# Altium project E12_STM32H750IBK6_SOM_V1.PrjPcb
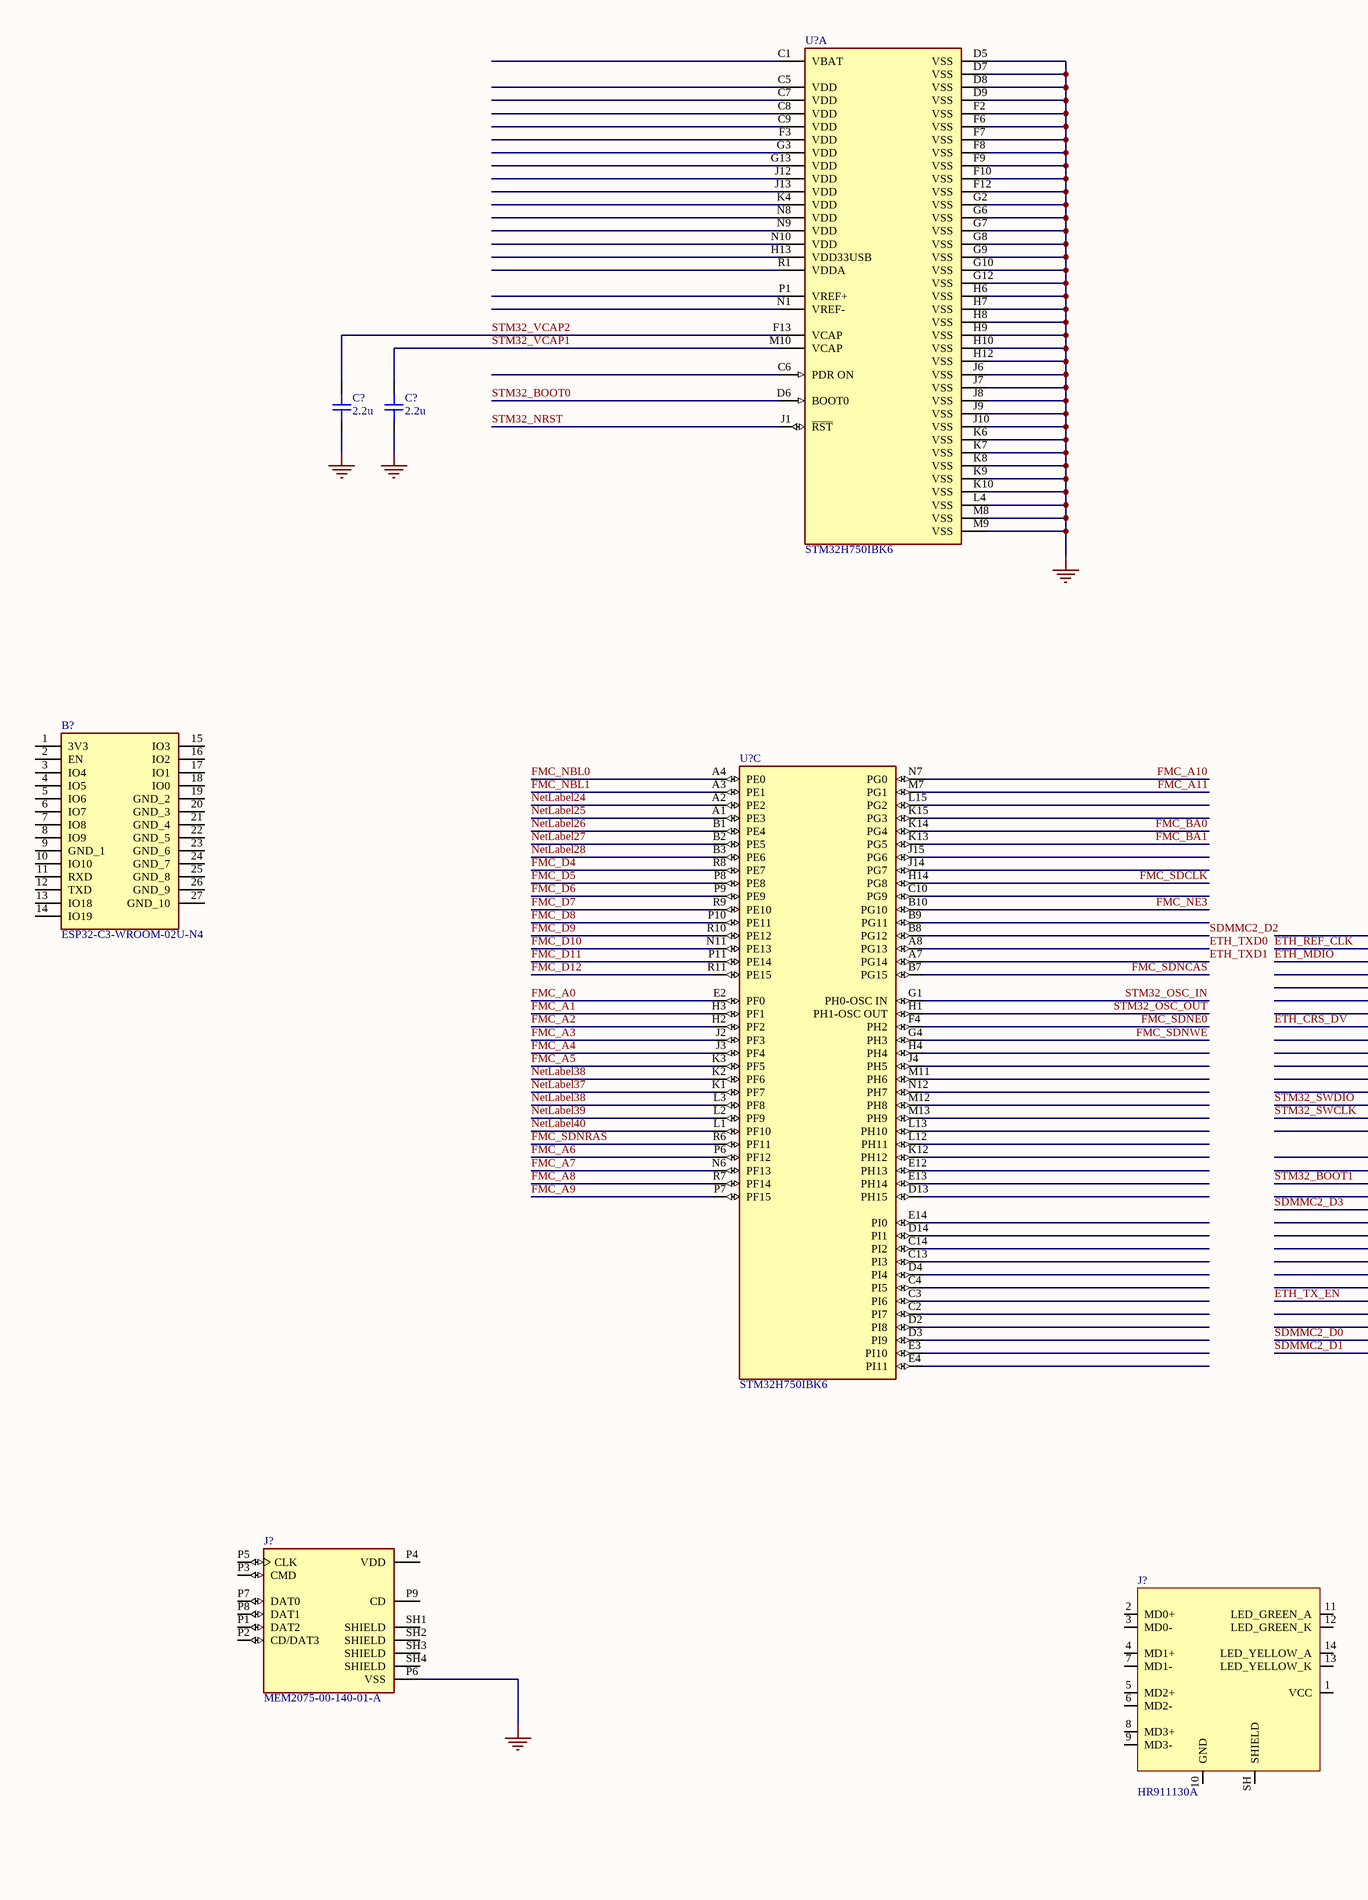
[diagram p0: Schematic1.SchDoc, left]
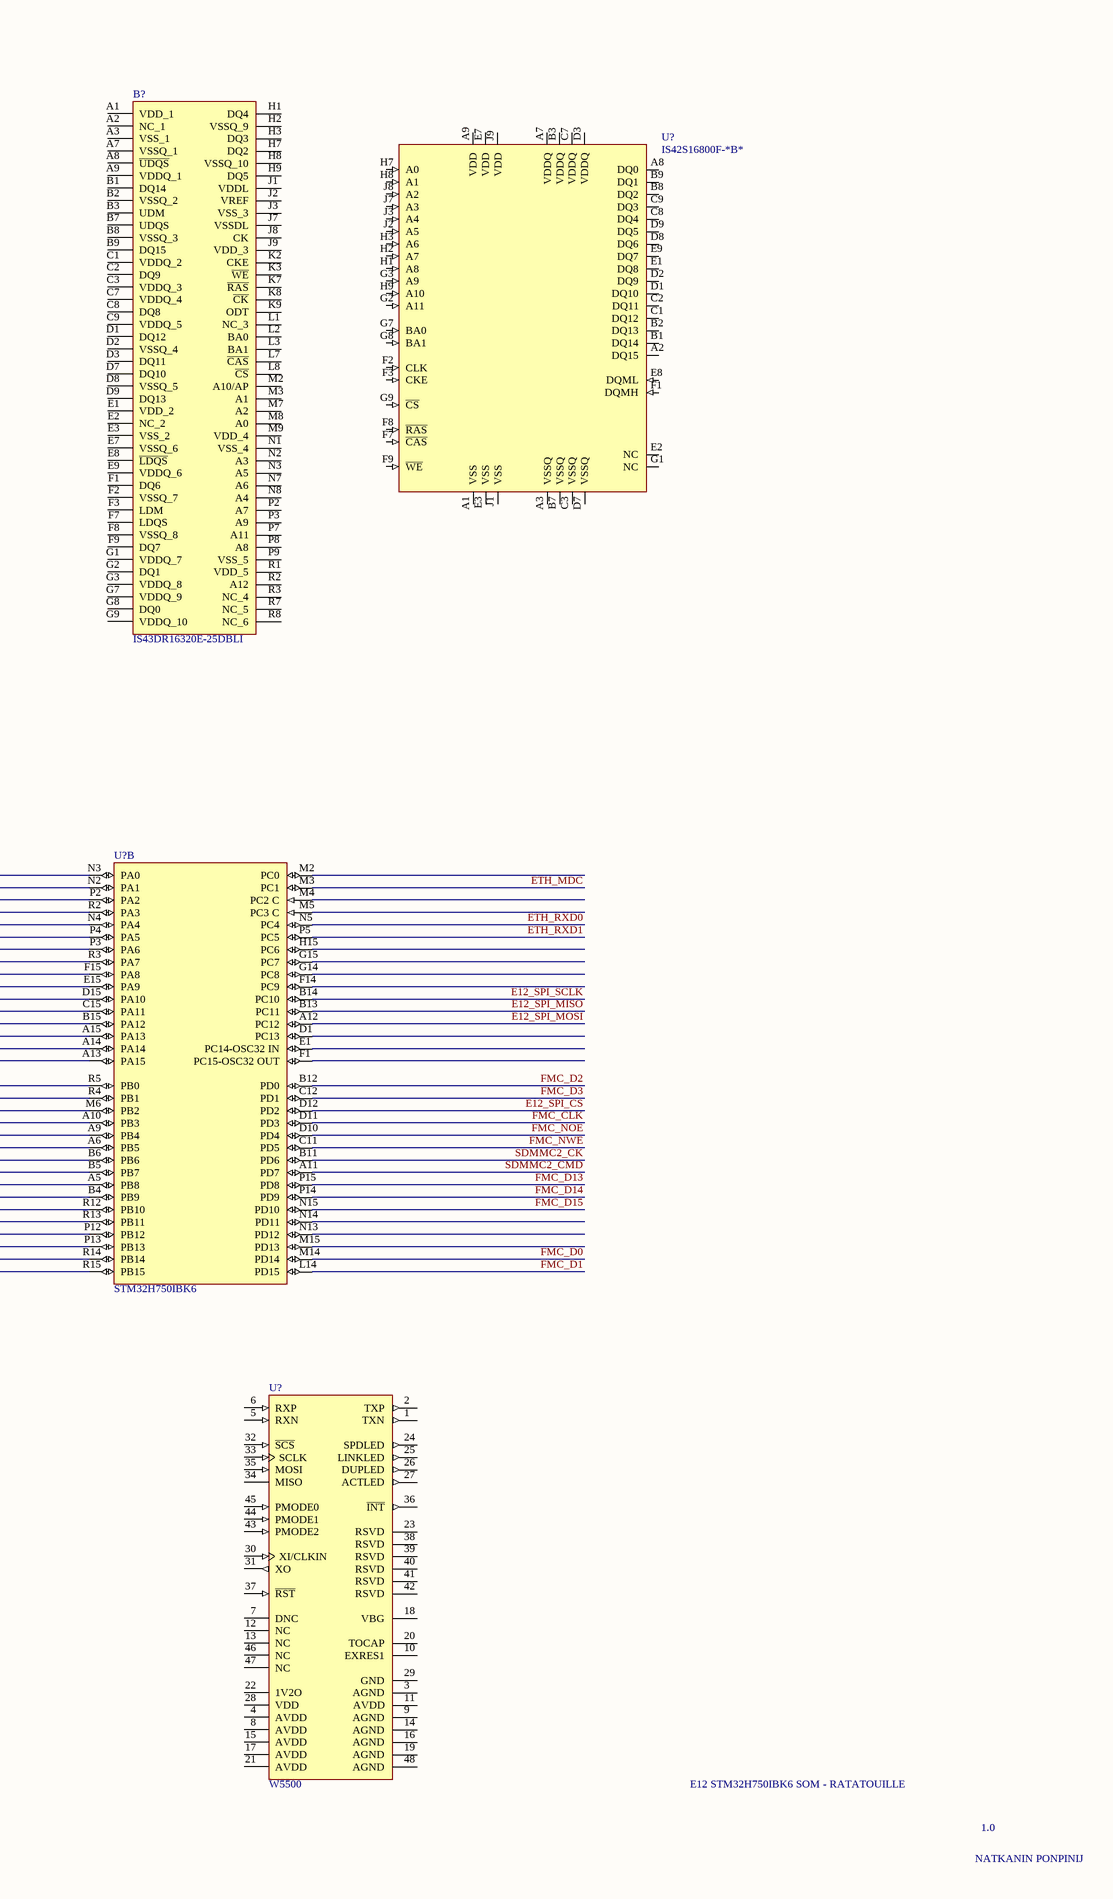
[diagram p1: Schematic1.SchDoc, right]
1 sheet, 11 parts. Net scope: global (net labels, ports and power ports of the same name join across sheets).

## Sheet Schematic1.SchDoc
size A2; SheetNumber: 1; SheetTotal: 1

### Parts
(Parts that share a designator on the sheet are numbered #1, #2 ... from top to bottom, then left to right.)
B?#1  IS43DR16320E-25DBLI  [BGA84C80P9X15_800X1250X120]
B?#2  ESP32-C3-WROOM-02U-N4  [ESP32C3WROOM02UN4]
C?#1  2.2u  [CAP_0402]
C?#2  2.2u  [CAP_0402]
J?#1  MEM2075-00-140-01-A  [GCT_MEM2075-00-140-01-A]
J?#2  HR911130A  [HR911130A]
U?#1  STM32H750IBK6  [FP-UFBGA176+25-A0E7-MFG]  (part A of 3)
U?#2  IS42S16800F-*B*  [BGA54C80P9X9_800X800X120]
U?#3  STM32H750IBK6  [FP-UFBGA176+25-A0E7-MFG]  (part C of 3)
U?#4  STM32H750IBK6  [FP-UFBGA176+25-A0E7-MFG]  (part B of 3)
U?#5  W5500  [WIZ-W5500-LQFP-48_M]

### Nets
GND: C?#1.1 C?#2.1 J?#1.P6(VSS) U?#1.D5(VSS) U?#1.D7(VSS) U?#1.D8(VSS) U?#1.D9(VSS) U?#1.F2(VSS) U?#1.F6(VSS) U?#1.F7(VSS) U?#1.F8(VSS) U?#1.F9(VSS) U?#1.F10(VSS) U?#1.F12(VSS) U?#1.G2(VSS) U?#1.G6(VSS) U?#1.G7(VSS) U?#1.G8(VSS) U?#1.G9(VSS) U?#1.G10(VSS) U?#1.G12(VSS) U?#1.H6(VSS) U?#1.H7(VSS) U?#1.H8(VSS) U?#1.H9(VSS) U?#1.H10(VSS) U?#1.H12(VSS) U?#1.J6(VSS) U?#1.J7(VSS) U?#1.J8(VSS) U?#1.J9(VSS) U?#1.J10(VSS) U?#1.K6(VSS) U?#1.K7(VSS) U?#1.K8(VSS) U?#1.K9(VSS) U?#1.K10(VSS) U?#1.L4(VSS) U?#1.M8(VSS) U?#1.M9(VSS)
E12_SPI_CS: U?#4.D12(PD2)
E12_SPI_MISO: U?#4.B13(PC11)
E12_SPI_MOSI: U?#4.A12(PC12)
E12_SPI_SCLK: U?#4.B14(PC10)
ETH_CRS_DV: U?#4.R3(PA7)
ETH_MDC: U?#4.M3(PC1)
ETH_MDIO: U?#4.P2(PA2)
ETH_REF_CLK: U?#4.N2(PA1)
ETH_RXD0: U?#4.N5(PC4)
ETH_RXD1: U?#4.P5(PC5)
ETH_TX_EN: U?#4.R13(PB11)
ETH_TXD0: U?#3.A8(PG13)
ETH_TXD1: U?#3.A7(PG14)
FMC_A0: U?#3.E2(PF0)
FMC_A1: U?#3.H3(PF1)
FMC_A2: U?#3.H2(PF2)
FMC_A3: U?#3.J2(PF3)
FMC_A4: U?#3.J3(PF4)
FMC_A5: U?#3.K3(PF5)
FMC_A6: U?#3.P6(PF12)
FMC_A7: U?#3.N6(PF13)
FMC_A8: U?#3.R7(PF14)
FMC_A9: U?#3.P7(PF15)
FMC_A10: U?#3.N7(PG0)
FMC_A11: U?#3.M7(PG1)
FMC_BA0: U?#3.K14(PG4)
FMC_BA1: U?#3.K13(PG5)
FMC_CLK: U?#4.D11(PD3)
FMC_D0: U?#4.M14(PD14)
FMC_D1: U?#4.L14(PD15)
FMC_D2: U?#4.B12(PD0)
FMC_D3: U?#4.C12(PD1)
FMC_D4: U?#3.R8(PE7)
FMC_D5: U?#3.P8(PE8)
FMC_D6: U?#3.P9(PE9)
FMC_D7: U?#3.R9(PE10)
FMC_D8: U?#3.P10(PE11)
FMC_D9: U?#3.R10(PE12)
FMC_D10: U?#3.N11(PE13)
FMC_D11: U?#3.P11(PE14)
FMC_D12: U?#3.R11(PE15)
FMC_D13: U?#4.P15(PD8)
FMC_D14: U?#4.P14(PD9)
FMC_D15: U?#4.N15(PD10)
FMC_NBL0: U?#3.A4(PE0)
FMC_NBL1: U?#3.A3(PE1)
FMC_NE3: U?#3.B10(PG10)
FMC_NOE: U?#4.D10(PD4)
FMC_NWE: U?#4.C11(PD5)
FMC_SDCLK: U?#3.H14(PG8)
FMC_SDNCAS: U?#3.B7(PG15)
FMC_SDNE0: U?#3.F4(PH2)
FMC_SDNRAS: U?#3.R6(PF11)
FMC_SDNWE: U?#3.G4(PH3)
NetLabel24: U?#3.A2(PE2)
NetLabel25: U?#3.A1(PE3)
NetLabel26: U?#3.B1(PE4)
NetLabel27: U?#3.B2(PE5)
NetLabel28: U?#3.B3(PE6)
NetLabel37: U?#3.K1(PF7)
NetLabel38: U?#3.K2(PF6) U?#3.L3(PF8)
NetLabel39: U?#3.L2(PF9)
NetLabel40: U?#3.L1(PF10)
SDMMC2_CK: U?#4.B11(PD6)
SDMMC2_CMD: U?#4.A11(PD7)
SDMMC2_D0: U?#4.R14(PB14)
SDMMC2_D1: U?#4.R15(PB15)
SDMMC2_D2: U?#3.B8(PG12)
SDMMC2_D3: U?#4.A9(PB4)
STM32_BOOT0: U?#1.D6(BOOT0)
STM32_BOOT1: U?#4.M6(PB2)
STM32_NRST: U?#1.J1(~{RST})
STM32_OSC_IN: U?#3.G1(PH0-OSC_IN)
STM32_OSC_OUT: U?#3.H1(PH1-OSC_OUT)
STM32_SWCLK: U?#4.A14(PA14)
STM32_SWDIO: U?#4.A15(PA13)
STM32_VCAP1: C?#2.2 U?#1.M10(VCAP)
STM32_VCAP2: C?#1.2 U?#1.F13(VCAP)

Not connected (* = marked no-connect by the designer): B?#1 A1(VDD_1) A2(NC_1) A3(VSS_1) A7(VSSQ_1) A8(~{UDQS}) A9(VDDQ_1) B1(DQ14) B2(VSSQ_2) B3(UDM) B7(UDQS) B8(VSSQ_3) B9(DQ15) C1(VDDQ_2) C2(DQ9) C3(VDDQ_3) C7(VDDQ_4) C8(DQ8) C9(VDDQ_5) D1(DQ12) D2(VSSQ_4) D3(DQ11) D7(DQ10) D8(VSSQ_5) D9(DQ13) E1(VDD_2) E2(NC_2) E3(VSS_2) E7(VSSQ_6) E8(~{LDQS}) E9(VDDQ_6) F1(DQ6) F2(VSSQ_7) F3(LDM) F7(LDQS) F8(VSSQ_8) F9(DQ7) G1(VDDQ_7) G2(DQ1) G3(VDDQ_8) G7(VDDQ_9) G8(DQ0) G9(VDDQ_10) H1(DQ4) H2(VSSQ_9) H3(DQ3) H7(DQ2) H8(VSSQ_10) H9(DQ5) J1(VDDL) J2(VREF) J3(VSS_3) J7(VSSDL) J8(CK) J9(VDD_3) K2(CKE) K3(~{WE}) K7(~{RAS}) K8(~{CK}) K9(ODT) L1(NC_3) L2(BA0) L3(BA1) L7(~{CAS}) L8(~{CS}) M2(A10/AP) M3(A1) M7(A2) M8(A0) M9(VDD_4) N1(VSS_4) N2(A3) N3(A5) N7(A6) N8(A4) P2(A7) P3(A9) P7(A11) P8(A8) P9(VSS_5) R1(VDD_5) R2(A12) R3(NC_4) R7(NC_5) R8(NC_6); B?#2 1(3V3) 2(EN) 3(IO4) 4(IO5) 5(IO6) 6(IO7) 7(IO8) 8(IO9) 9(GND_1) 10(IO10) 11(RXD) 12(TXD) 13(IO18) 14(IO19) 15(IO3) 16(IO2) 17(IO1) 18(IO0) 19(GND_2) 20(GND_3) 21(GND_4) 22(GND_5) 23(GND_6) 24(GND_7) 25(GND_8) 26(GND_9) 27(GND_10); J?#1 P1(DAT2) P2(CD/DAT3) P3(CMD) P4(VDD) P5(CLK) P7(DAT0) P8(DAT1) P9(CD) SH1(SHIELD) SH2(SHIELD) SH3(SHIELD) SH4(SHIELD); J?#2 1(VCC) 2(MD0+) 3(MD0-) 4(MD1+) 5(MD2+) 6(MD2-) 7(MD1-) 8(MD3+) 9(MD3-) 10(GND) 11(LED_GREEN_A) 12(LED_GREEN_K) 13(LED_YELLOW_K) 14(LED_YELLOW_A) SH(SHIELD); U?#1 C1(VBAT) C5(VDD) C6(PDR_ON) C7(VDD) C8(VDD) C9(VDD) F3(VDD) G3(VDD) G13(VDD) H13(VDD33USB) J12(VDD) J13(VDD) K4(VDD) N1(VREF-) N8(VDD) N9(VDD) N10(VDD) P1(VREF+) R1(VDDA); U?#2 A1(VSS) A2(DQ15) A3(VSSQ) A7(VDDQ) A8(DQ0) A9(VDD) B1(DQ14) B2(DQ13) B3(VDDQ) B7(VSSQ) B8(DQ2) B9(DQ1) C1(DQ12) C2(DQ11) C3(VSSQ) C7(VDDQ) C8(DQ4) C9(DQ3) D1(DQ10) D2(DQ9) D3(VDDQ) D7(VSSQ) D8(DQ6) D9(DQ5) E1(DQ8) E2(NC) E3(VSS) E7(VDD) E8(DQML) E9(DQ7) F1(DQMH) F2(CLK) F3(CKE) F7(~{CAS}) F8(~{RAS}) F9(~{WE}) G1(NC) G2(A11) G3(A9) G7(BA0) G8(BA1) G9(~{CS}) H1(A8) H2(A7) H3(A6) H7(A0) H8(A1) H9(A10) J1(VSS) J2(A5) J3(A4) J7(A3) J8(A2) J9(VDD); U?#3 B9(PG11) C2(PI7) C3(PI6) C4(PI5) C10(PG9) C13(PI3) C14(PI2) D2(PI8) D3(PI9) D4(PI4) D13(PH15) D14(PI1) E3(PI10) E4(PI11) E12(PH13) E13(PH14) E14(PI0) H4(PH4) J4(PH5) J14(PG7) J15(PG6) K12(PH12) K15(PG3) L12(PH11) L13(PH10) L15(PG2) M11(PH6) M12(PH8) M13(PH9) N12(PH7); U?#4 A5(PB8) A6(PB5) A10(PB3) A13(PA15) B4(PB9) B5(PB7) B6(PB6) B15(PA12) C15(PA11) D1(PC13) D15(PA10) E1(PC14-OSC32_IN) E15(PA9) F1(PC15-OSC32_OUT) F14(PC9) F15(PA8) G14(PC8) G15(PC7) H15(PC6) M2(PC0) M4(PC2_C) M5(PC3_C) M15(PD13) N3(PA0) N4(PA4) N13(PD12) N14(PD11) P3(PA6) P4(PA5) P12(PB12) P13(PB13) R2(PA3) R4(PB1) R5(PB0) R12(PB10); U?#5 1(TXN) 2(TXP) 3(AGND) 4(AVDD) 5(RXN) 6(RXP) 7(DNC) 8(AVDD) 9(AGND) 10(EXRES1) 11(AVDD) 12(NC) 13(NC) 14(AGND) 15(AVDD) 16(AGND) 17(AVDD) 18(VBG) 19(AGND) 20(TOCAP) 21(AVDD) 22(1V2O) 23(RSVD) 24(SPDLED) 25(LINKLED) 26(DUPLED) 27(ACTLED) 28(VDD) 29(GND) 30(XI/CLKIN) 31(XO) 32(~{SCS}) 33(SCLK) 34(MISO) 35(MOSI) 36(~{INT}) 37(~{RST}) 38(RSVD) 39(RSVD) 40(RSVD) 41(RSVD) 42(RSVD) 43(PMODE2) 44(PMODE1) 45(PMODE0) 46(NC) 47(NC) 48(AGND)

### Notes on the sheet
- E12 STM32H750IBK6 SOM - RATATOUILLE
- NATKANIN PONPINIJ
- 1.0

### Library data of the parts
B?#1 = CMP-023-000000-1: INTEGRATED SILICON SOLUTION (ISSI) - IS43DR16320E-25DBLI - DRAM, 32M X 16BIT, BGA-84; Manufacturer_Name: Integrated Silicon Solution Inc.; Geometry.Height: 1.2mm; Datasheet Link: http://www.issi.com/WW/pdf/43-46DR86400E-16320E.pdf; Arrow Part Number: IS43DR16320E-25DBLI; Mouser Price/Stock: https://www.mouser.co.uk/ProductDetail/ISSI/IS43DR16320E-25DBLI?qs=TO8kDJPmCBSFAFA4ahdKYw%3D%3D; Design Item ID: IS43DR16320E-25DBLI; Source: IS43DR16320E-25DBLI.SchLib; Arrow Price/Stock: https://www.arrow.com/en/products/is43dr16320e-25dbli/integrated-silicon-solution-inc; Manufacturer_Part_Number: IS43DR16320E-25DBLI; Mouser Part Number: 870-43DR16320E25DBLI
B?#2 = ESP32-C3-WROOM-02U-N4: Multiprotocol Modules SMD module, ESP32-C3, 4MB SPI flash, IPEX antenna, -40 C +85 C; Manufacturer_Name: Espressif Systems; Geometry.Height: 3.35mm; Manufacturer_Part_Number: ESP32-C3-WROOM-02U-N4; Mouser Part Number: 356-ESP32C3WROM02UN4; Mouser Price/Stock: https://www.mouser.co.uk/ProductDetail/Espressif-Systems/ESP32-C3-WROOM-02U-N4?qs=pBJMDPsKWf2Ces2aXBSNjQ%3D%3D; Arrow Part Number: *; Arrow Price/Stock: *; Datasheet Link: https://www.espressif.com/sites/default/files/documentation/esp32-c3-wroom-02_datasheet_en.pdf
C?#1 C?#2 = CAP_0402_10V: Capacitor SMD 0402 10V
J?#1 = MEM2075-00-140-01-A: Micro SD Memory Card Connector, 1.4mm Profile SMT, Push-Push, with Normally open Switch; MP: MEM2075-00-140-01-A; Value: *; Price: None; Package: None; Availability: Unavailable
J?#2 = CMP-006-000011-1: 100/1000Base-T Magnetics Single-Port RJ45 Connector with Integrated Magnetics and LEDs; Manufacturer: Hanrun; Design Item ID: HR911130A; Manufacturer Part Number: HR911130A; Source: Schematic-Lib-PhilsLab.SchLib
U?#1 U?#3 U?#4 = CMP-12105-000026-1: IC MCU 32BIT 128KB FLASH 176UBGA; Manufacturer: STMicroelectronics; Core Architecture: ARM Cortex-M7; Frequency: 480MHz; Memory Size: 128KBytes; Ram Size: 1MBytes; Number Of Cores: 1; Number Of Timers/Counters: 20; Max Junction Temp: +125°C; Number Of Uart Channels: 9; Number Of Pwm Channels: 42; Number Of Usb Channels: 2; Number Of I/Os: 140; Interface: I2C,SPI,UART,USART,CAN,USB,LIN,IrDA,Ethernet,I2S,Other; Number Of Spi Channels: 6; Max Supply Voltage: 3.6V; Data Bus Width: 32bits; Number Of A/D Converters: 3; Number Of Adc Channels: 36; Number Of I2C Channels: 4; Min Supply Voltage: 1.62V; Mouser Description: MCU 32-Bit STM32H750IB ARM Cortex M7 RISC 128KB Flash 1.8V/2.5V/3.3V 176-Pin UFBGA Tray; Automotive: No; Manufacturer Part Number: STM32H750IBK6; Ambient Temperature Range High: +85°C; Category: IC; Temperature Range High: +125°C; ComponentLink2Description: Datasheet; Lead Free: Yes; Device Class L2: Embedded Processors and Controllers; Temperature: -40°C to +125°C; Ambient Temperature Range Low: -40°C; Digikey Description: IC MCU 32BIT 128KB FLASH 176UBGA; Height: 0.6mm; Memory Type: FLASH; Octopart: https://octopart.com/stm32h750ibk6-stmicroelectronics-94048546; ComponentLink2URL: https://www.st.com/resource/en/datasheet/stm32h750vb.pdf; Ipc Land Pattern Name: BGA225N65P15X15_1015X1015X60; Device Class L3: Microcontrollers; RoHS: TRUE; Package: UFBGA176+25-A0E7; Device Class L1: Integrated Circuits (ICs); Number Of Ethernet Channels: 1; Temperature Range Low: -40°C
U?#2 = IS42S16800F-*B: SDRAM 128Mbit 8Mx16 143Mhz 3.3V 54-ball BGA; Manufacturer: ISSI; Manufacturer Part Number: IS42S16800F-*B*
U?#5 = CMP-020-00020-3: Hardwired TCP/IP Embedded Ethernet Controller, 3.3 V, 25 MHz, -40 to 85 degC, 48-Pin LQFP, RoHS, Tray; Manufacturer: WIZnet; Interface: SPI; Min Supply Voltage: 2.97V; Max Supply Voltage: 3.63V; Package Quantity: 250; Package Description: 48-Pin Low-profile Quad Flat Package, Body 7.00 x 7.00 mm, Pitch 0.50 mm; Package Reference: LQFP-48; Case/Package: LQFP; RoHS Compliant: True; Mounting Technology: SM; Datasheet URL: http://wizwiki.net/wiki/lib/exe/fetch.php?media=products:w5500:w5500_ds_v106e_141230.pdf; Manufacturer URL: http://www.wiznet.co.kr/; Packaging: Tray; Min Operating Temperature: -40°C; Pins: 48; Datasheet Version: Rev. 1.0.6, 12/2014; Max Operating Temperature: 85°C